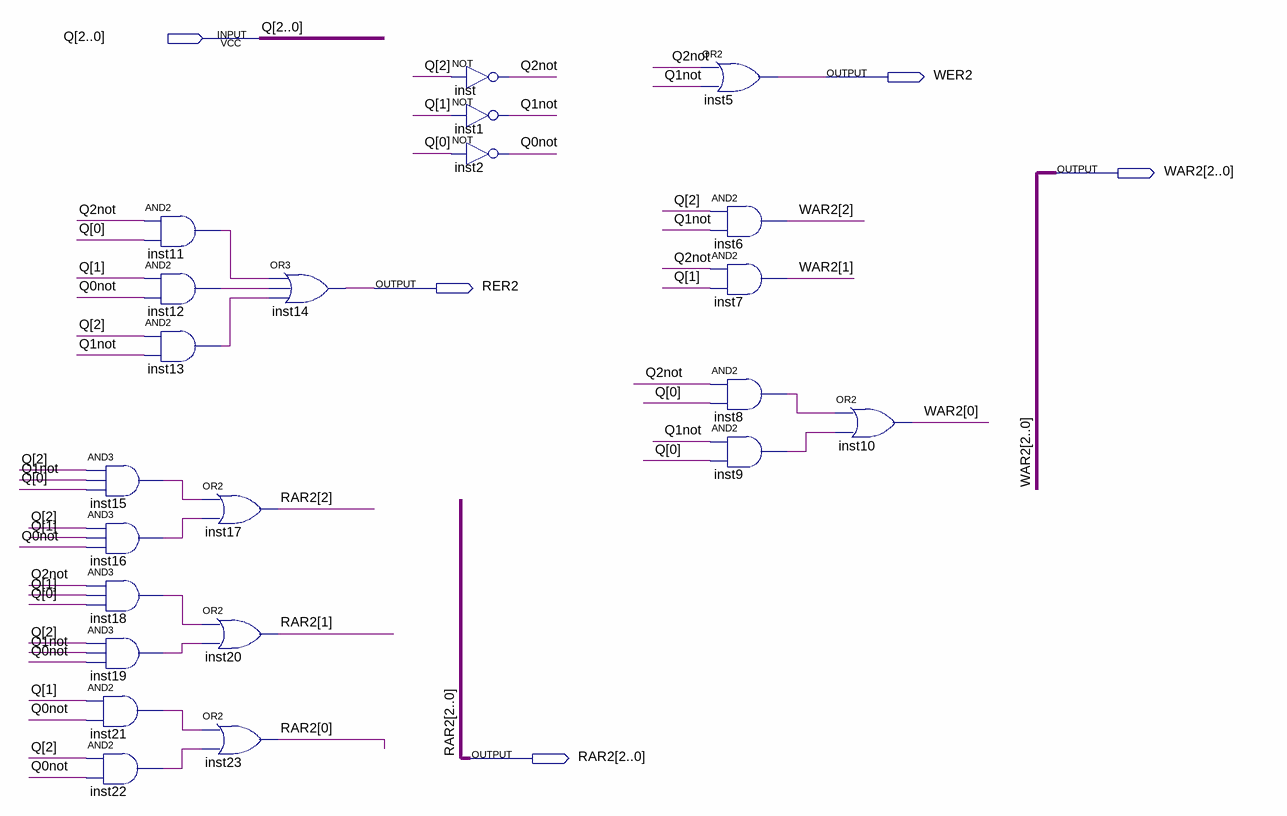
[diagram p0: schematic sheet]
// Quartus schematic R2.bdf as structural Verilog: 22 symbols, 5 pins
module R2 (
  input  [2:0] Q,
  output WER2,
  output [2:0] WAR2,
  output RER2,
  output [2:0] RAR2
);

  wire inst8_out, inst9_out, inst11_out, inst12_out, inst13_out, inst15_out, inst16_out, inst18_out,
       inst19_out, inst21_out, inst22_out, Q0not, Q1not, Q2not;

  and inst15 (inst15_out, Q[2], Q1not, Q[0]);
  and inst16 (inst16_out, Q[2], Q[1], Q0not);
  and inst18 (inst18_out, Q2not, Q[1], Q[0]);
  and inst19 (inst19_out, Q[2], Q1not, Q0not);
  and inst21 (inst21_out, Q[1], Q0not);
  and inst22 (inst22_out, Q[2], Q0not);
  and inst11 (inst11_out, Q2not, Q[0]);
  and inst12 (inst12_out, Q[1], Q0not);
  and inst13 (inst13_out, Q[2], Q1not);
  or inst17 (RAR2[2], inst15_out, inst16_out);
  or inst20 (RAR2[1], inst18_out, inst19_out);
  or inst23 (RAR2[0], inst21_out, inst22_out);
  or inst14 (RER2, inst11_out, inst12_out, inst13_out);
  not inst (Q2not, Q[2]);
  not inst1 (Q1not, Q[1]);
  not inst2 (Q0not, Q[0]);
  or inst5 (WER2, Q2not, Q1not);
  and inst6 (WAR2[2], Q[2], Q1not);
  and inst7 (WAR2[1], Q2not, Q[1]);
  and inst8 (inst8_out, Q2not, Q[0]);
  and inst9 (inst9_out, Q1not, Q[0]);
  or inst10 (WAR2[0], inst8_out, inst9_out);
endmodule
